# EAGLE design ZedImgBoard3 (EAGLE 6.5.0)
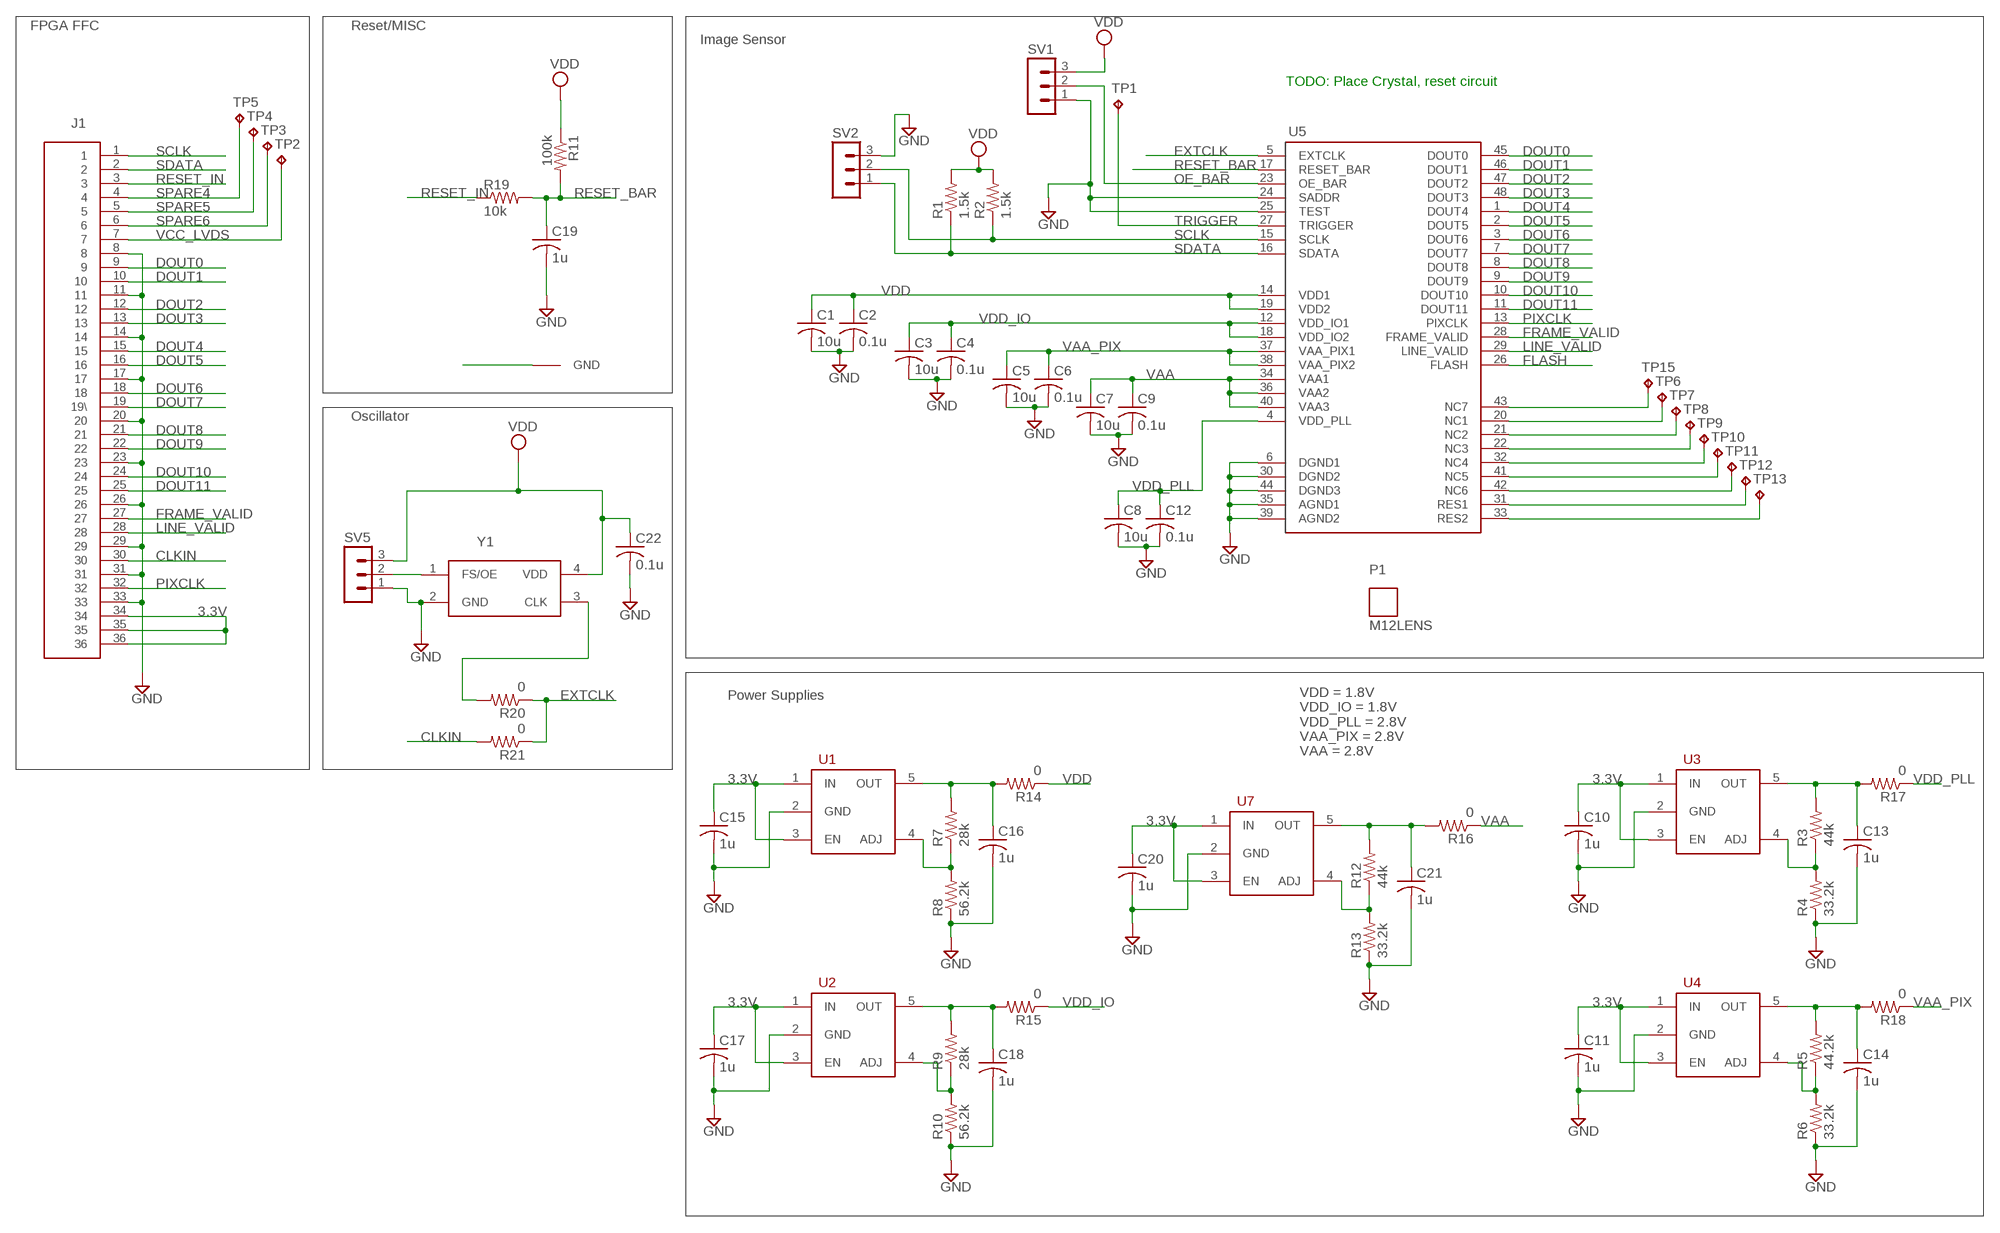
[diagram p0: schematic, sheet 1]

## Parts
C1  10u  C-USC0805  [C0805]
C2  0.1u  C-USC0805  [C0805]
C3  10u  C-USC0805  [C0805]
C4  0.1u  C-USC0805  [C0805]
C5  10u  C-USC0805  [C0805]
C6  0.1u  C-USC0805  [C0805]
C7  10u  C-USC0805  [C0805]
C8  10u  C-USC0805  [C0805]
C9  0.1u  C-USC0805  [C0805]
C10  1u  C-USC0805  [C0805]
C11  1u  C-USC0805  [C0805]
C12  0.1u  C-USC0805  [C0805]
C13  1u  C-USC0805  [C0805]
C14  1u  C-USC0805  [C0805]
C15  1u  C-USC0805  [C0805]
C16  1u  C-USC0805  [C0805]
C17  1u  C-USC0805  [C0805]
C18  1u  C-USC0805  [C0805]
C19  1u  C-USC0805  [C0805]
C20  1u  C-USC0805  [C0805]
C21  1u  C-USC0805  [C0805]
C22  0.1u  C-USC0805  [C0805]
J1  MOLEX_54132_3662  [MOLEX_54132_3662]
P1  M12LENS  [M12LENS]
R1  1.5k  R-US_M0805  [M0805]
R2  1.5k  R-US_M0805  [M0805]
R3  44k  R-US_M0805  [M0805]
R4  33.2k  R-US_M0805  [M0805]
R5  44.2k  R-US_M0805  [M0805]
R6  33.2k  R-US_M0805  [M0805]
R7  28k  R-US_M0805  [M0805]
R8  56.2k  R-US_M0805  [M0805]
R9  28k  R-US_M0805  [M0805]
R10  56.2k  R-US_M0805  [M0805]
R11  100k  R-US_M0805  [M0805]
R12  44k  R-US_M0805  [M0805]
R13  33.2k  R-US_M0805  [M0805]
R14  0  R-US_M0805  [M0805]
R15  0  R-US_M0805  [M0805]
R16  0  R-US_M0805  [M0805]
R17  0  R-US_M0805  [M0805]
R18  0  R-US_M0805  [M0805]
R19  10k  R-US_M0805  [M0805]
R20  0  R-US_M0805  [M0805]
R21  0  R-US_M0805  [M0805]
SV1  MA03-1  [MA03-1]
SV2  MA03-1  [MA03-1]
SV5  MA03-1  [MA03-1]
TP1  TPB1,27  [B1,27]
TP2  TPB1,27  [B1,27]
TP3  TPB1,27  [B1,27]
TP4  TPB1,27  [B1,27]
TP5  TPB1,27  [B1,27]
TP6  TPB1,27  [B1,27]
TP7  TPB1,27  [B1,27]
TP8  TPB1,27  [B1,27]
TP9  TPB1,27  [B1,27]
TP10  TPB1,27  [B1,27]
TP11  TPB1,27  [B1,27]
TP12  TPB1,27  [B1,27]
TP13  TPB1,27  [B1,27]
TP15  TPB1,27  [B1,27]
U1  TPS73201DB  [SOT23-5]
U2  TPS73201DB  [SOT23-5]
U3  TPS73201DB  [SOT23-5]
U4  TPS73201DB  [SOT23-5]
U5  AR0331  [ILCC48]
U7  TPS73201DB  [SOT23-5]
U$4  GND_LUG  [GND_PAD]
Y1  SILABS_501AAAXXD  [4-SMD]

## Nets
1.8V: R1.2 R2.2 ; supply symbol labelled VDD
3.3V: C10.1 C11.1 C15.1 C17.1 C20.1 J1.34 J1.35 J1.36 U1.1(IN) U1.3(EN) U2.1(IN) U2.3(EN) U3.1(IN) U3.3(EN) U4.1(IN) U4.3(EN) U7.1(IN) U7.3(EN)
CLKIN: J1.30 R21.2
DOUT0: J1.9 U5.45(DOUT0)
DOUT1: J1.10 U5.46(DOUT1)
DOUT2: J1.12 U5.47(DOUT2)
DOUT3: J1.13 U5.48(DOUT3)
DOUT4: J1.15 U5.1(DOUT4)
DOUT5: J1.16 U5.2(DOUT5)
DOUT6: J1.18 U5.3(DOUT6)
DOUT7: J1.19(19\) U5.7(DOUT7)
DOUT8: J1.21 U5.8(DOUT8)
DOUT9: J1.22 U5.9(DOUT9)
DOUT10: J1.24 U5.10(DOUT10)
DOUT11: J1.25 U5.11(DOUT11)
EXTCLK: R20.1 R21.1 U5.5(EXTCLK)
FLASH: U5.26(FLASH)
FRAME_VALID: J1.27 U5.28(FRAME_VALID)
GND: C1.2 C2.2 C3.2 C4.2 C5.2 C6.2 C7.2 C8.2 C9.2 C10.2 C11.2 C12.2 C13.2 C14.2 C15.2 C16.2 C17.2 C18.2 C19.2 C20.2 C21.2 C22.2 J1.8 J1.11 J1.14 J1.17 J1.20 J1.23 J1.26 J1.29 J1.31 J1.33 R4.1 R6.1 R8.1 R10.1 R13.1 SV1.1 SV2.3 SV5.1 U1.2(GND) U2.2(GND) U3.2(GND) U4.2(GND) U5.6(DGND1) U5.24(SADDR) U5.25(TEST) U5.30(DGND2) U5.35(AGND1) U5.39(AGND2) U5.44(DGND3) U7.2(GND) U$4.P$1(GND) Y1.2(GND)
LINE_VALID: J1.28 U5.29(LINE_VALID)
N$1: R7.1 R8.2 U1.4(ADJ)
N$2: R9.1 R10.2 U2.4(ADJ)
N$3: R12.1 R13.2 U7.4(ADJ)
N$4: TP15.TP U5.43(NC7)
N$5: TP6.TP U5.20(NC1)
N$6: TP7.TP U5.21(NC2)
N$7: TP8.TP U5.22(NC3)
N$8: TP9.TP U5.32(NC4)
N$9: TP10.TP U5.41(NC5)
N$10: TP11.TP U5.42(NC6)
N$11: TP12.TP U5.31(RES1)
N$12: TP13.TP U5.33(RES2)
N$13: SV5.2 Y1.1(FS/OE)
N$15: R20.2 Y1.3(CLK)
N$37: R3.1 R4.2 U3.4(ADJ)
N$40: R5.1 R6.2 U4.4(ADJ)
OE_BAR: SV1.2 U5.23(OE_BAR)
PIXCLK: J1.32 U5.13(PIXCLK)
RESET_BAR: C19.1 R11.2 R19.2 U5.17(RESET_BAR)
RESET_IN: J1.3 R19.1
SCLK: J1.1 R2.1 SV2.2 U5.15(SCLK)
SDATA: J1.2 R1.1 SV2.1 U5.16(SDATA)
SPARE4: J1.4 TP5.TP
SPARE5: J1.5 TP4.TP
SPARE6: J1.6 TP3.TP
TRIGGER: TP1.TP U5.27(TRIGGER)
VAA: C7.1 C9.1 R16.1 U5.34(VAA1) U5.36(VAA2) U5.40(VAA3)
VAA_H: C21.1 R12.2 R16.2 U7.5(OUT)
VAA_PIX: C5.1 C6.1 R18.1 U5.37(VAA_PIX1) U5.38(VAA_PIX2)
VAA_PIX_H: C14.1 R5.2 R18.2 U4.5(OUT)
VCC_LVDS: J1.7 TP2.TP
VDD: C1.1 C2.1 C22.1 R11.1 R14.1 SV1.3 SV5.3 U5.14(VDD1) U5.19(VDD2) Y1.4(VDD)
VDD_H: C16.1 R7.2 R14.2 U1.5(OUT)
VDD_IO: C3.1 C4.1 R15.1 U5.12(VDD_IO1) U5.18(VDD_IO2)
VDD_IO_H: C18.1 R9.2 R15.2 U2.5(OUT)
VDD_PLL: C8.1 C12.1 R17.1 U5.4(VDD_PLL)
VDD_PLL_H: C13.1 R3.2 R17.2 U3.5(OUT)

## Notes on the sheet
- FPGA FFC | Reset/MISC
- Image Sensor
- TODO: Place Crystal, reset circuit
- Oscillator
- Power Supplies
- VDD = 1.8V
  VDD_IO = 1.8V
  VDD_PLL = 2.8V
  VAA_PIX = 2.8V
  VAA = 2.8V

## Library data of the parts
C1-C22 = resistor:C-US: CAPACITOR, American symbol
J1 = NicksParts:MOLEX_54132_3662
P1 = NicksParts:M12LENS
R1-R21 = resistor:R-US_: RESISTOR, American symbol
SV1 SV2 SV5 = con-lstb:MA03-1: PIN HEADER; OC_FARNELL: unknown; OC_NEWARK: unknown
TP1-TP13 TP15 = testpad:TP: Test pad
U1-U4 U7 = NicksParts:TPS73201DB
U5 = NicksParts:AR0331
U$4 = NicksParts:GND_LUG
Y1 = NicksParts:SILABS_501AAAXXD

## Board
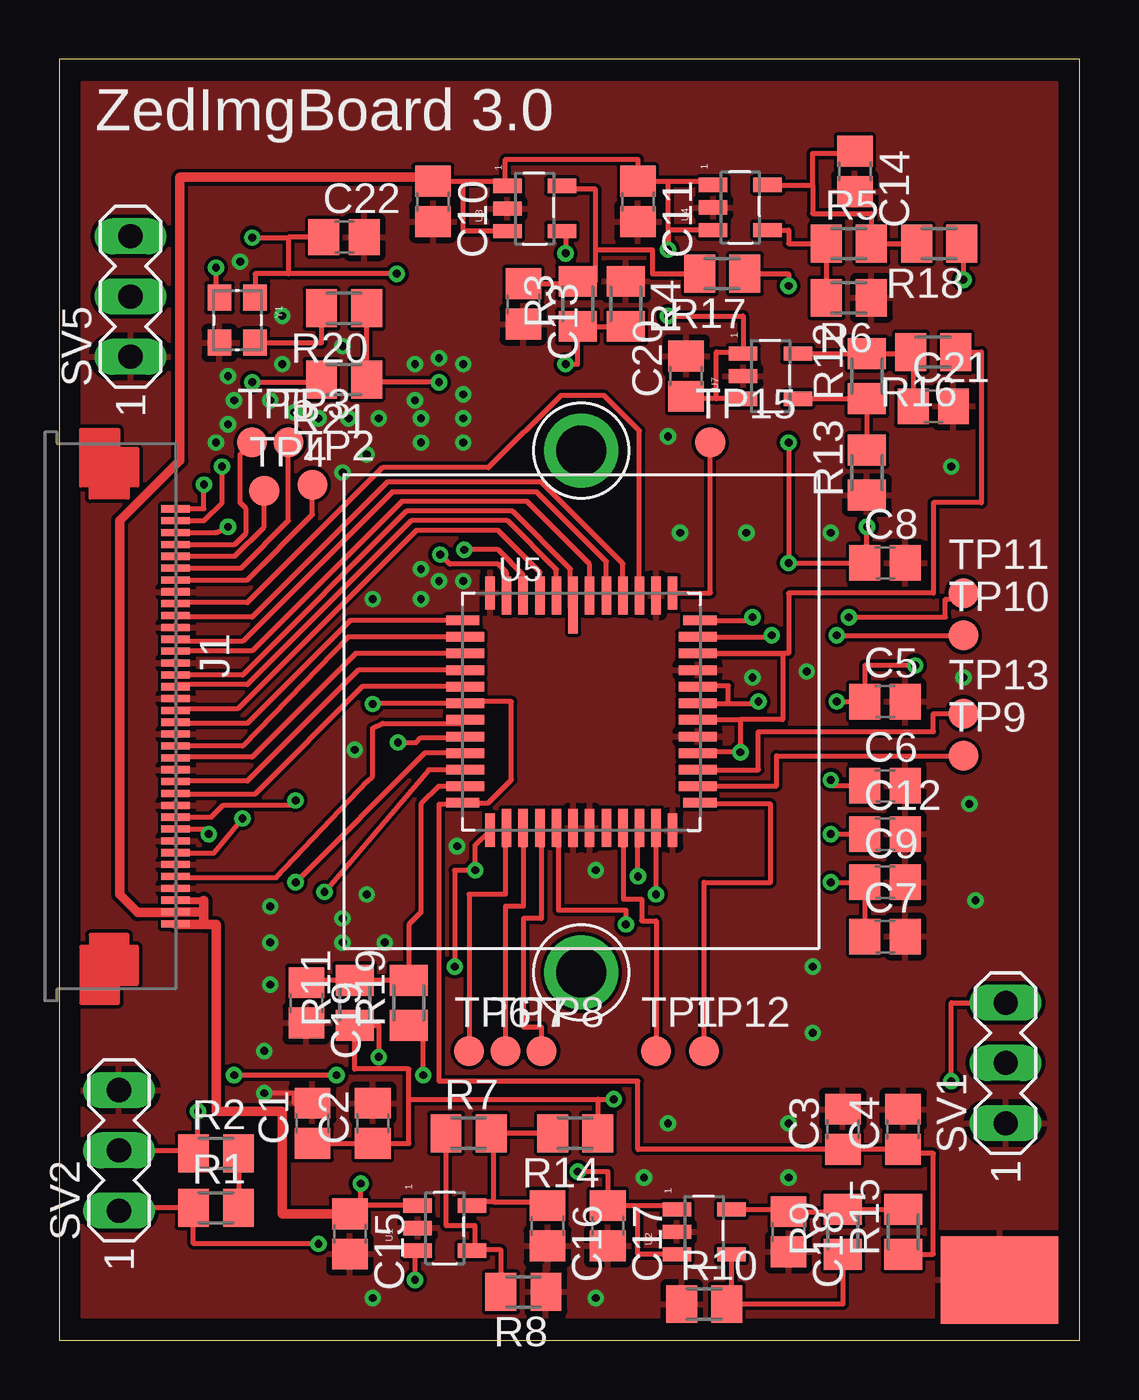
[diagram p1: board, top side]
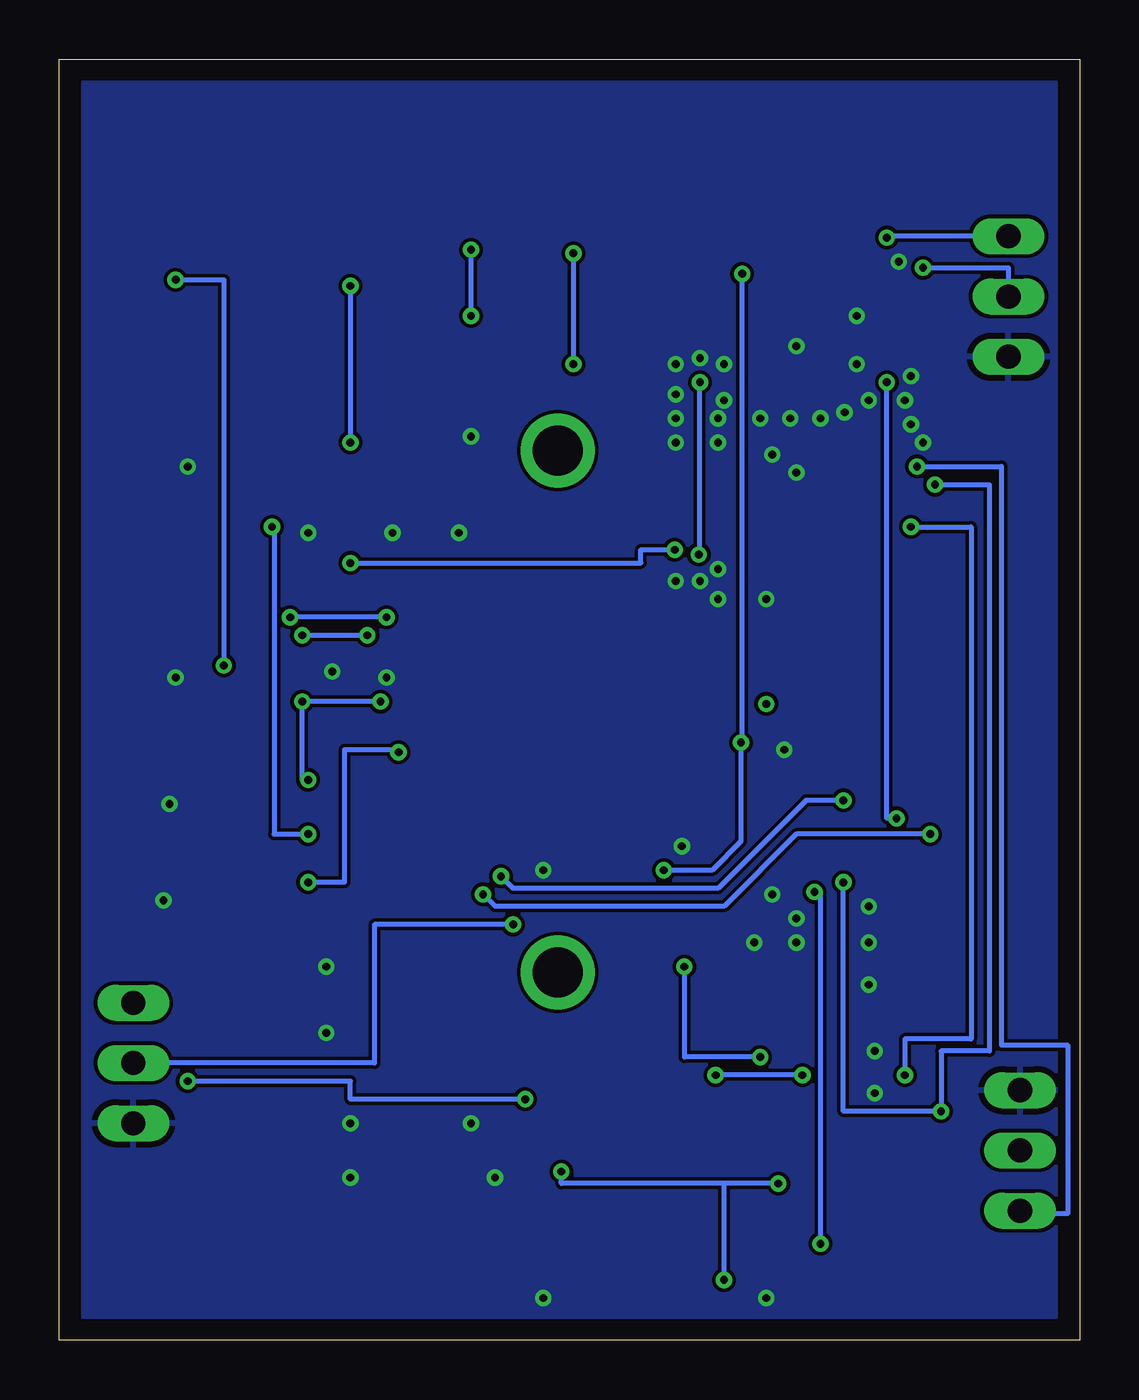
[diagram p2: board, bottom side, seen from below]

Size 43 x 54 mm. Coordinates in mm from the lower left corner, seen from the top.
Outline: 0,0 43,0 43,54 0,54 0,0
Copper layers (1*16): Top 0.0356mm / dielectric 1.5011mm / Bottom 0.0356mm
Design rules "LaenPCBOrder": minimum track width 6mil, minimum drill 13mil, track to track 6mil, track to pad 6mil, pad to pad 6mil, via to via 6mil, smd to smd 6mil, copper to edge 15mil, drill to drill 6mil, minimum pad ring 7mil, minimum via ring 7mil, stop-mask expansion 3mil, vias tented up to drill 0mil, thermal gap 10mil

### Footprints (pad centres in the part's own frame; a part is rotated, then mirrored left to right if it is on the bottom)
C0805 = smd 1.3 x 1.5: 1 -0.85,0; 2 0.85,0
MOLEX_54132_3662 = smd 0.3 x 1.2: 1 -8.75,2.5; 2 -8.25,2.5; 3 -7.75,2.5; 4 -7.25,2.5; 5 -6.75,2.5; 6 -6.25,2.5; 7 -5.75,2.5; 8 -5.25,2.5; 9 -4.75,2.5; 10 -4.25,2.5; 11 -3.75,2.5; 12 -3.25,2.5; 13 -2.75,2.5; 14 -2.25,2.5; 15 -1.75,2.5; 16 -1.25,2.5; 17 -0.75,2.5; 18 -0.25,2.5; 19 0.25,2.5; 20 0.75,2.5; 21 1.25,2.5; 22 1.75,2.5; 23 2.25,2.5; 24 2.75,2.5; 25 3.25,2.5; 26 3.75,2.5; 27 4.25,2.5; 28 4.75,2.5; 29 5.25,2.5; 30 5.75,2.5; 31 6.25,2.5; 32 6.75,2.5; 33 7.25,2.5; 34 7.75,2.5; 35 8.25,2.5; 36 8.75,2.5
M12LENS = drill 2.1 pad 3: P$1 11,0; P$3 -11,0
M0805 = smd 1.3 x 1.6: 1 -0.95,0; 2 0.95,0
MA03-1 = drill 1.016 long: 1 -2.54,0; 2 0,0; 3 2.54,0
B1,27 = smd 1.27 x 1.27: TP 0,0
SOT23-5 = smd 0.6 x 1.2: 1 0.95,1.15; 2 0,1.15; 3 -0.95,1.15; 4 -0.95,-1.15; 5 0.95,-1.15
ILCC48 = smd 0.4 x 2.4: 1 -0.35,4.5 | smd 0.4 x 1.6: 2 -1.05,4.9; 3 -1.75,4.9; 4 -2.45,4.9; 5 -3.15,4.9; 20 -3.15,-4.9; 21 -2.45,-4.9; 22 -1.75,-4.9; 23 -1.05,-4.9; 24 -0.35,-4.9; 25 0.35,-4.9; 26 1.05,-4.9; 27 1.75,-4.9; 28 2.45,-4.9; 29 3.15,-4.9; 44 3.15,4.9; 45 2.45,4.9; 46 1.75,4.9; 47 1.05,4.9; 48 0.35,4.9 | smd 0.4 x 1.4: 6 -3.85,5; 19 -3.85,-5; 30 3.85,-5; 43 3.85,5 | smd 1.4 x 0.4: 7 -5,3.85; 18 -5,-3.85; 31 5,-3.85; 42 5,3.85 | smd 1.6 x 0.4: 8 -4.9,3.15; 9 -4.9,2.45; 10 -4.9,1.75; 11 -4.9,1.05; 12 -4.9,0.35; 13 -4.9,-0.35; 14 -4.9,-1.05; 15 -4.9,-1.75; 16 -4.9,-2.45; 17 -4.9,-3.15; 32 4.9,-3.15; 33 4.9,-2.45; 34 4.9,-1.75; 35 4.9,-1.05; 36 4.9,-0.35; 37 4.9,0.35; 38 4.9,1.05; 39 4.9,1.75; 40 4.9,2.45; 41 4.9,3.15
GND_PAD = smd 4.953 x 3.683: P$1 0,0
4-SMD = smd 1.1 x 1: 1 -0.95,-0.75; 2 0.95,-0.75; 3 0.95,0.75; 4 -0.95,0.75

### Placement (x,y rotation side)
C1  10.67,9.14 90 top
C2  13.21,9.14 90 top
C3  33.02,8.89 90 top
C4  35.56,8.89 90 top
C5  34.8,26.92 0 top
C6  34.8,23.37 0 top
C7  34.8,17.02 0 top
C8  34.8,32.77 0 top
C9  34.8,19.3 0 top
C10  15.75,48.01 270 top
C11  24.38,48.01 270 top
C12  34.8,21.34 0 top
C13  19.56,43.69 270 top
C14  33.53,49.28 270 top
C15  12.25,4.48 270 top
C16  20.57,4.83 270 top
C17  23.11,4.83 270 top
C18  30.73,4.57 270 top
C19  10.41,14.22 270 top
C20  26.42,40.64 90 top
C21  36.83,39.37 0 top
C22  12,46.5 0 top
J1  2.4,26.3 270 top
P1  22,26.5 90 top
R1  6.6,5.59 0 top
R2  6.6,7.87 0 top
R3  21.84,43.69 90 top
R4  23.88,43.69 270 top
R5  33.27,46.23 0 top
R6  33.27,43.94 180 top
R7  17.25,8.73 0 top
R8  19.56,2.03 180 top
R9  33.02,4.57 90 top
R10  27.18,1.52 0 top
R11  12.45,14.22 90 top
R12  34.04,40.64 90 top
R13  34.04,36.58 90 top
R14  21.75,8.73 180 top
R15  35.56,4.57 90 top
R16  36.83,41.66 180 top
R17  27.94,44.96 180 top
R18  37.08,46.23 180 top
R19  14.73,14.22 90 top
R20  12,43.5 180 top
R21  12,40.5 180 top
SV1  39.88,11.68 90 top
SV2  2.51,8 90 top
SV5  3,44 90 top
TP1  25.15,12.19 0 top
TP2  10.67,36.07 0 top
TP3  9.65,37.85 0 top
TP4  8.64,35.81 0 top
TP5  8.13,37.85 0 top
TP6  17.27,12.19 0 top
TP7  18.8,12.19 0 top
TP8  20.32,12.19 0 top
TP9  38.1,24.64 0 top
TP10  38.1,29.72 0 top
TP11  38.1,31.5 0 top
TP12  27.18,12.19 0 top
TP13  38.1,26.42 0 top
TP15  27.43,37.85 0 top
U1  16.25,4.73 90 top
U2  27.18,4.57 90 top
U3  20.03,47.71 90 top
U4  28.7,47.75 90 top
U5  22,26.5 0 top
U7  29.97,40.64 90 top
U$4  39.62,2.54 0 top
Y1  7.5,43 270 top

### Tracks (layer width: path | path; a pad name or v marks a point on that pad's centre or on a via)
1.8V
  Top 0.203: R2.2 R1.2
3.3V  (via drill 0.33)
  Top 0.203: U1.1 12.7,5.68 | C15.1 12.5,5.68 12.7,5.68 | 12.7,5.68 v12.7,6.6 | v21.84,7.11 23.11,7.11 C17.1 24.38,5.68 | 24.38,5.68 26.03,5.68 U2.1 | U2.3 24.38,3.62 24.38,5.68 | C10.1 17.02,48.86 | 17.02,48.86 18.8,48.86 | U3.1 18.88,48.86 18.8,48.86 | U3.3 17.02,46.76 17.02,48.86 | 18.8,48.86 18.8,49.78 24.38,49.78 C11.1 25.65,48.86 | 25.65,48.86 27.55,48.86 U4.1 | 25.65,46.8 25.65,48.86 | U4.3 25.65,46.8 | 25.65,46.8 v25.65,45.97 | v25.65,43.18 28.82,43.18 U7.1 28.82,41.66 27.69,41.66 27.69,39.69 U7.3 26.42,39.69 C20.1 | U1.3 14.99,3.78 v14.99,2.54
  Top 0.305: J1.34 6.1,18.55
  Top 0.406: 6.1,18.55 6.1,18.05 | 6.1,18.05 6.1,17.53 | 6.1,17.53 4.9,17.53 J1.36 | 6.1,18.05 J1.35 4.83,18.03 3.3,18.03 2.54,18.8 2.54,34.54 5.08,37.08 5.08,49.02 15.75,49.02 C10.1 | 6.1,17.53 6.6,17.53 6.6,9.65 9.4,9.65 9.4,5.33 C15.1
  Bottom 0.203: v12.7,6.6 14.99,6.6 | 14.99,6.6 21.84,6.6 v21.84,7.11 | v25.65,45.97 v25.65,43.18 | v14.99,2.54 14.99,6.6
CLKIN  (via drill 0.33)
  Top 0.203: J1.30 6.53,20.55 v7.72,22 | 10.97,40.42 R21.2 11.05,40.39 v8.13,40.39
  Bottom 0.203: v7.72,22 8.13,22 v8.13,40.39
DOUT0
  Top 0.203: U5.45 24.45,38.34 22.96,39.83 21.13,39.83 18.09,36.78 13.61,36.78 7.92,31.09 4.94,31.09 J1.9
DOUT1
  Top 0.203: U5.46 23.75,32.74 20.32,36.17 13.82,36.17 8.13,30.48 4.97,30.48 J1.10
DOUT2
  Top 0.203: U5.47 23.05,32.83 20.12,35.76 14.02,35.76 7.72,29.46 4.99,29.46 J1.12
DOUT3
  Top 0.203: U5.48 22.35,32.72 19.71,35.36 14.43,35.36 8.13,29.06 J1.13
DOUT4
  Top 0.203: U5.1 21.54,30.89 21.54,32.51 19.1,34.95 14.63,34.95 7.72,28.04 J1.15
DOUT5
  Top 0.203: U5.2 20.95,32.49 18.9,34.54 14.83,34.54 7.92,27.64 4.99,27.64 J1.16
DOUT6
  Top 0.203: U5.3 20.25,32.38 18.49,34.14 15.04,34.14 7.52,26.62 4.97,26.62 J1.18
DOUT7
  Top 0.203: U5.7 12.27,30.35 7.92,26.01 4.94,26.01 J1.19
DOUT8
  Top 0.203: U5.8 12.18,29.65 7.72,25.04 5.2,25.04 J1.21
DOUT9
  Top 0.203: U5.9 12.49,28.95 8.13,24.59 4.94,24.59 J1.22
DOUT10
  Top 0.203: U5.10 12.6,28.25 7.92,23.57 4.92,23.57 J1.24
DOUT11
  Top 0.203: U5.11 12.77,27.55 8.23,23.01 4.94,23.01 J1.25
EXTCLK  (via drill 0.33)
  Top 0.203: U5.5 18.85,32.36 18.49,32.72 16.46,32.72 v16.05,33.12 | 13.01,40.44 R21.1 | R21.1 12.95,40.64 R20.1 | v16,40.39 12.95,40.39 R21.1
  Bottom 0.203: v16.05,33.12 16,33.12 v16,40.39
FRAME_VALID  (via drill 0.33)
  Top 0.203: J1.27 6.4,22.05 6.91,22.55 9.75,22.55 v9.96,22.76 | v24.38,19.56 24.38,21.53 U5.28
  Bottom 0.203: v9.96,22.76 11.53,22.76 15.24,19.05 23.88,19.05 v24.38,19.56
GND  (via drill 0.33)
  Top 0.203: C1.2 9.91,9.99 9.91,10.41 v8.64,10.41
  other vias: 13.21,1.78 22.61,1.78 24.64,6.86 30.73,6.86 30.73,9.14 25.65,9.14 31.75,12.95 31.75,15.75 38.61,18.54 38.35,22.61 38.1,27.94 31.5,28.19 29.21,27.94 22.61,19.81 32.51,34.04 37.59,36.83 28.96,34.04 26.16,34.04 25.65,38.1 17.02,37.85 17.02,38.86 17.02,39.88 17.02,41.15 16,41.4 14.99,41.15 14.99,39.62 15.24,38.86 15.24,37.85 15.24,32.51 16,32 17.02,32 13.21,31.24 11.94,36.58 12.95,37.34 13.46,38.86 12.19,38.86 10.92,38.86 8.89,39.62 9.91,39.12 11.94,41.91 9.4,41.15 7.11,40.64 7.37,39.62 7.11,38.61 6.6,37.85 9.4,43.18 7.62,45.47 15.24,31.24 12.45,24.89 12.95,18.8 16.76,20.83 8.89,18.29 8.89,16.76 11.94,17.78 11.94,16.76 13.72,16.76 8.89,14.99 8.64,12.19
  pour Top: 1,53 42,53 42,1 1,1
  pour Bottom: 1,53 42,53 42,1 1,1
LINE_VALID  (via drill 0.33)
  Top 0.203: J1.28 6.08,21.55 v6.3,21.34 | 25.2,21.55 U5.29 v25.15,18.8
  Bottom 0.203: v6.3,21.34 11.94,21.34 14.99,18.29 24.64,18.29 v25.15,18.8
N$1
  Top 0.203: 18.29,1.52 R8.2 18.61,3.81 17.4,3.81 U1.4 17.53,3.78 17.53,4.83 16.3,4.83 R7.1
N$2
  Top 0.203: U2.4 28.33,1.52 R10.2 33.02,1.52 R9.1
N$3
  Top 0.203: U7.4 R12.1 R13.2
N$4
  Top 0.203: U5.43 27.43,31.5 TP15.TP
N$5
  Top 0.203: U5.20 18.8,21.55 18.8,18.8 17.27,18.8 TP6.TP
N$6
  Top 0.203: U5.21 19.56,18.29 18.8,18.29 TP7.TP
N$7
  Top 0.203: U5.22 20.32,21.53 20.32,17.78 19.56,17.78 19.56,13.21 20.32,13.21 TP8.TP
N$8
  Top 0.203: U5.32 26.92,23.37 30.23,23.37 30.23,24.64 TP9.TP
N$9  (via drill 0.33)
  Top 0.203: U5.41 30.02,29.65 v30.02,29.72 | v32.77,29.72 TP10.TP
  Bottom 0.203: v30.02,29.72 v32.77,29.72
N$10  (via drill 0.33)
  Top 0.203: U5.42 29.21,30.35 v29.21,30.48 | v33.27,30.48 37.34,30.48 37.34,31.24 38.1,31.24 TP11.TP
  Bottom 0.203: v29.21,30.48 v33.27,30.48
N$11
  Top 0.203: TP12.TP 27.18,19.3 29.97,19.3 29.97,22.61 27,22.61 U5.31
N$12
  Top 0.203: U5.33 29.46,24.05 29.46,25.65 36.83,25.65 36.83,26.42 TP13.TP
N$13  (via drill 0.33)
  Top 0.203: Y1.1 6.6,43.95 v6.6,45.21
  Bottom 0.203: v6.6,45.21 3,45.21 SV5.2
N$15
  Top 0.203: Y1.3 11.05,42.05 R20.2
N$37  (via drill 0.33)
  Top 0.203: U3.4 21.34,46.76 v21.34,45.82 | v21.34,41.15 21.84,41.15 R3.1 R4.2
  Bottom 0.203: v21.34,45.82 v21.34,41.15
N$40
  Top 0.203: U4.4 30.73,46.8 30.73,46.23 R5.1 R6.2
OE_BAR  (via drill 0.33)
  Top 0.203: U5.23 21.08,21.47 21.03,21.47 21.03,18.14 23.88,18.14 v23.88,17.53
  Bottom 0.203: v23.88,17.53 29.72,17.53 29.72,11.68 SV1.2
PIXCLK
  Top 0.203: J1.32 4.94,19.51 9.14,19.51 13.01,23.57 13.21,23.77 13.21,25.81 13.61,26.01 16.96,26.01 U5.13
RESET_BAR
  Top 0.203: U5.17 15.98,23.35 15.24,22.61 15.24,18.03 14.73,17.53 R19.2 R11.2 10.51,15.17 C19.1
RESET_IN  (via drill 0.33)
  Top 0.203: v7.11,34.29 6.6,34.05 J1.3 | v7.37,11.18 v11.68,11.18 | v15.34,11.18 15.34,13.21 14.73,13.21 R19.1
  Bottom 0.203: v7.37,11.18 7.37,12.7 4.57,12.7 4.57,34.29 v7.11,34.29 | v11.68,11.18 v15.34,11.18
SCLK  (via drill 0.33)
  Top 0.203: U5.15 15.4,24.75 v9.96,19.3 | SV2.2 5.65,8 R2.1 5.84,7.87 v5.84,9.65 | J1.1 6.1,35.05 v6.1,36.07
  Bottom 0.203: v9.96,19.3 9.96,9.65 v5.84,9.65 5.84,12.19 3.81,12.19 3.81,36.07 v6.1,36.07
SDATA  (via drill 0.33)
  Top 0.203: U5.16 15.57,24.05 v11.18,18.9 | v10.92,4.06 5.65,4.06 R1.1 2.51,5.59 SV2.1 | J1.2 5.84,34.55 5.84,34.54 6.1,34.54 6.86,35.31 v6.86,36.83
  Bottom 0.203: v11.18,18.9 10.92,18.9 v10.92,4.06 | v6.86,36.83 3.3,36.83 3.3,12.45 0.51,12.45 0.51,5.33 2.26,5.33 SV2.1
SPARE4
  Top 0.203: J1.4 7.39,33.55 7.87,34.04 7.87,35.05 7.62,35.31 7.62,37.34 TP5.TP
SPARE5
  Top 0.203: J1.5 7.4,33.05 8.64,34.29 TP4.TP
SPARE6
  Top 0.203: J1.6 7.66,32.55 9.65,34.54 TP3.TP
TRIGGER
  Top 0.203: U5.27 23.77,21.6 23.77,18.59 24.54,18.59 24.54,17.68 25.15,17.68 TP1.TP
VAA  (via drill 0.33)
  Top 0.203: 26.91,26.16 U5.36 26.9,26.16 28.7,26.16 | 26.99,24.84 U5.34 26.9,24.79 v28.7,24.79 28.7,26.16 | R16.1 38.86,41.66 38.86,35.31 36.83,35.31 36.83,31.5 30.73,31.5 30.73,28.96 U5.40 30.48,28.95 30.48,26.16 28.7,26.16 | v32.51,19.3 C9.1 C7.1
  Bottom 0.203: v28.7,24.79 28.96,24.79 28.96,24.89 30.99,24.89 30.99,19.3 v32.51,19.3
VAA_H
  Top 0.203: U7.5 R12.2 35.88,41.59 | 35.88,41.59 R16.2 35.98,41.66 | 35.88,41.59 35.98,41.59 C21.1
VAA_PIX  (via drill 0.33)
  Top 0.203: R18.1 38.1,46.23 v38.1,44.7 | v36.07,28.45 33.95,28.45 C5.1 v32.77,26.92 | U5.37 28.19,26.85 | 28.19,26.85 28.19,27.58 26.9,27.58 U5.38 | 28.19,26.85 29.46,26.85 v29.46,26.92 | C6.1 32.51,23.37 v32.51,23.62
  Bottom 0.203: v38.1,44.7 36.07,44.7 v36.07,28.45 | v29.46,26.92 v32.77,26.92 32.77,23.62 v32.51,23.62
VAA_PIX_H
  Top 0.203: U4.5 31.75,48.7 | 31.75,48.7 31.75,50.04 33.53,50.04 C14.1 | 31.75,48.7 31.75,47.5 34.22,47.5 R5.2 R18.2
VCC_LVDS
  Top 0.203: J1.7 7.92,32.05 10.67,34.8 TP2.TP
VDD  (via drill 0.33)
  Top 0.203: v14.27,25.2 15.04,25.2 15.24,25.4 17.05,25.4 U5.14 | C1.1 C2.1 14.73,8.29 14.73,10.16 | 14.73,10.16 14.73,11.43 12.45,11.43 R11.1 13.46,13.27 v13.46,11.94 | 14.73,10.16 22.7,10.16 | 22.7,10.16 R14.1 | U5.19 17.53,20.88 v17.53,19.81 16.66,19.81 v16.66,15.75 | v14.22,44.96 9.65,44.96 | 9.65,44.96 8.25,44.96 Y1.4 | C22.1 9.65,46.5 9.65,46.48 | 9.65,46.48 9.65,44.96 | v8.13,46.48 9.65,46.48 | 22.7,10.16 v23.37,10.16 | v37.59,10.92 37.59,14.22 SV1.3
  Bottom 0.203: v13.46,11.94 16.66,11.94 v16.66,15.75 | v17.53,19.81 15.49,19.81 14.27,21.03 v14.27,25.2 14.22,25.2 v14.22,44.96 | SV5.3 8.13,46.54 v8.13,46.48 | v23.37,10.16 30.73,10.16 30.73,10.92 v37.59,10.92
VDD_H
  Top 0.203: R14.2 R7.2 18.29,8.73 18.29,5.84 | 18.29,5.84 17.4,5.84 U1.5 | 18.29,5.84 20.57,5.84 C16.1
VDD_IO  (via drill 0.33)
  Top 0.203: v13.21,26.82 13.24,26.85 U5.12 17.17,26.92 19.05,26.92 19.05,23.62 18.08,22.65 U5.18 17,22.61 16,22.61 16,10.92 24.38,10.92 24.38,8.04 C3.1 C4.1 35.56,7.87 36.83,7.87 36.83,3.62 R15.1
VDD_IO_H
  Top 0.203: U2.5 30.73,5.52 C18.1 33.02,5.42 R9.2 R15.2
VDD_PLL  (via drill 0.33)
  Top 0.203: U5.4 19.55,32.27 18.49,33.33 v17.07,33.33 | R17.1 30.73,44.96 v30.73,44.45 | v30.73,37.85 v30.73,32.77 C8.1 34.04,32.77 v34.04,34.29 | v32.51,21.34 C12.1
  Bottom 0.203: v30.73,44.45 v30.73,37.85 | v30.73,32.77 18.49,32.77 18.49,33.33 v17.07,33.33 | v34.04,34.29 33.95,34.29 C12.1 v32.51,21.34
VDD_PLL_H
  Top 0.203: 26.74,44.7 R17.2 24.99,44.96 24.99,45.97 22.61,45.97 | C13.1 21.84,44.54 R3.2 22.61,44.64 22.61,45.97 | 22.61,45.97 22.61,48.51 21.18,48.51 U3.5

### Text on the board
tPlace: ZedImgBoard 3.0
tDocu: VDD_PLL | VAA_PIX | OSC Enable | OSC | VAA | OE | SCLK | VDD | VDD_IO | SDATA